# EAGLE design tvbgone3 (EAGLE 7.3.0)
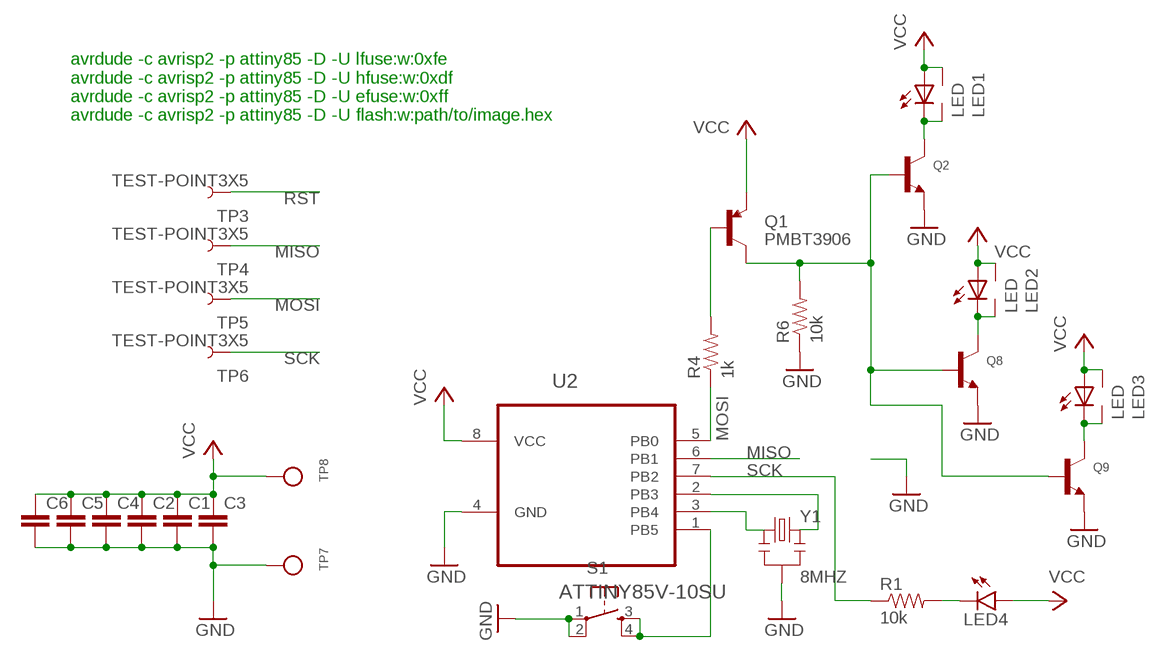
[diagram p0: schematic, sheet 1]

## Parts
C1  CAP0603-CAP  [0603-CAP]
C2  CAP0603-CAP  [0603-CAP]
C3  CAP0603-CAP  [0603-CAP]
C4  CAP0603-CAP  [0603-CAP]
C5  CAP0603-CAP  [0603-CAP]
C6  CAP0603-CAP  [0603-CAP]
LED1  LED  [5MM-SIDE]
LED2  LED  [5MM-SIDE]
LED3  LED  [5MM-SIDE]
LED4  LED0603  [LED-0603]
Q1  PMBT3906  TRANSISTOR_PNPPMBT3906  [SOT23-3]
Q2  TRANSISTOR_NPN  [SOT-23-R]
Q8  TRANSISTOR_NPN  [SOT-23-R]
Q9  TRANSISTOR_NPN  [SOT-23-R]
R1  10k  RESISTOR0603  [0603-RES]
R4  1k  RESISTOR0603  [0603-RES]
R6  10k  RESISTOR0603  [0603-RES]
S1  TAC_SWITCHSMD  [TACTILE-SWITCH-SMD]
TP3  TEST-POINT3X5  [PAD.03X.05]
TP4  TEST-POINT3X5  [PAD.03X.05]
TP5  TEST-POINT3X5  [PAD.03X.05]
TP6  TEST-POINT3X5  [PAD.03X.05]
TP7  TESTPOINTPAD  [TESTPOINT_PAD_2MM]
TP8  TESTPOINTPAD  [TESTPOINT_PAD_2MM]
U2  ATTINY85V-10SU  [SOIC127P798X216-8N]
Y1  8MHZ  RESONATOR8MHZ  [RESONATOR-SMD]

## Nets
GND: C1.2 C2.2 C3.2 C4.2 C5.2 C6.2 Q2.3-EMITTER(E) Q8.3-EMITTER(E) Q9.3-EMITTER(E) R6.1 S1.1 S1.2 TP7.P$1 U2.4(GND) Y1.2
MISO: TP4.P$1 U2.6(PB1)
MOSI: R4.1 TP5.P$1 U2.5(PB0)
N$1: U2.3(PB4) Y1.1
N$2: U2.2(PB3) Y1.3
N$3: LED4.C R1.2
N$4: LED1.K2(C1) LED1.K(C) Q2.2-COLLECTOR(C)
N$5: LED2.K2(C1) LED2.K(C) Q8.2-COLLECTOR(C)
N$6: Q1.1(B) R4.2
N$7: LED3.K2(C1) LED3.K(C) Q9.2-COLLECTOR(C)
N$10: Q1.3(C) Q2.1-BASE(B) Q8.1-BASE(B) Q9.1-BASE(B) R6.2
RST: S1.3 S1.4 TP3.P$1 U2.1(PB5)
SCK: R1.1 TP6.P$1 U2.7(PB2)
VCC: C1.1 C2.1 C3.1 C4.1 C5.1 C6.1 LED1.A LED1.A2(A1) LED2.A LED2.A2(A1) LED3.A LED3.A2(A1) LED4.A Q1.2(E) TP8.P$1 U2.8(VCC)

## Notes on the sheet
- avrdude -c avrisp2 -p attiny85 -D -U lfuse:w:0xfe
  avrdude -c avrisp2 -p attiny85 -D -U hfuse:w:0xdf
  avrdude -c avrisp2 -p attiny85 -D -U efuse:w:0xff
  avrdude -c avrisp2 -p attiny85 -D -U flash:w:path/to/image.hex

## Library data of the parts
C1-C6 = homemade-hardware:CAP: Capacitor Standard 0603 ceramic capacitor, and 0.1" leaded capacitor.
LED1-LED3 = tvbgone:LED
LED4 = homemade-hardware:LED: LEDs Standard schematic elements and footprints for 5mm, 3mm, 1206, and 0603 sized LEDs. 5mm - Spark Fun Electronics SKU : COM-00529 (and others)
Q1 = SparkFun-DiscreteSemi:TRANSISTOR_PNP: Generic PNP BJT Double check pinouts against datasheets- not all devices are the same! MMBT3906 - 40V 200mA SOT-23 (TRANS-08052) MMBT4403 - 40V 600mA SOT-23 (TRANS-09245); PROD_ID: TRANS-08052
Q2 Q8 Q9 = Tomorrow_Lab_LLC:TRANSISTOR_NPN: NPN Transistor Transistor (NPN) 500mA 45V - BC817 [Digikey: 568-1631-1-ND] SOT23-R - SOT23 footprint optimised for use with solder paste and reflow ovens. SOT23-W - SOT23 footprint optimised for hand-soldering (larger pads).
R1 R4 R6 = homemade-hardware:RESISTOR: Resistor Basic schematic elements and footprints for 0603, 1206, and PTH resistors.
S1 = SparkFun-Electromechanical:TAC_SWITCH: Momentary Switch Button commonly used for reset or general input. Spark Fun Electronics SKU : COM-00097 SMT- SWCH-08247
TP3-TP6 = SparkFun-Passives:TEST-POINT: Bare copper test points for troubleshooting or ICT
TP7 TP8 = microbuilder:TESTPOINT: Test Point Various test points for characterisation and PCB testing TESTPOINT_SMT - Compact Surface Mount Test Point [Digikey: 5016KTR-ND]
U2 = Atmel_By_element14_Batch_1:ATTINY85V-10SU: 8-bit Microcontroller with In-System Programmable Flash; MPN: ATTINY85V-10SU; OC_FARNELL: 1455166; OC_NEWARK: 58M3799; PACKAGE: SOIC-8; SUPPLIER: Atmel
Y1 = homemade-hardware:RESONATOR: Resonator Small SMD resonator. Used, eg, on the Arduino Pro/ Pro Mini boards. 8MHz- XTAL-08895 16MHz- XTAL-08900; PROD_ID: XTAL-08895

## Board
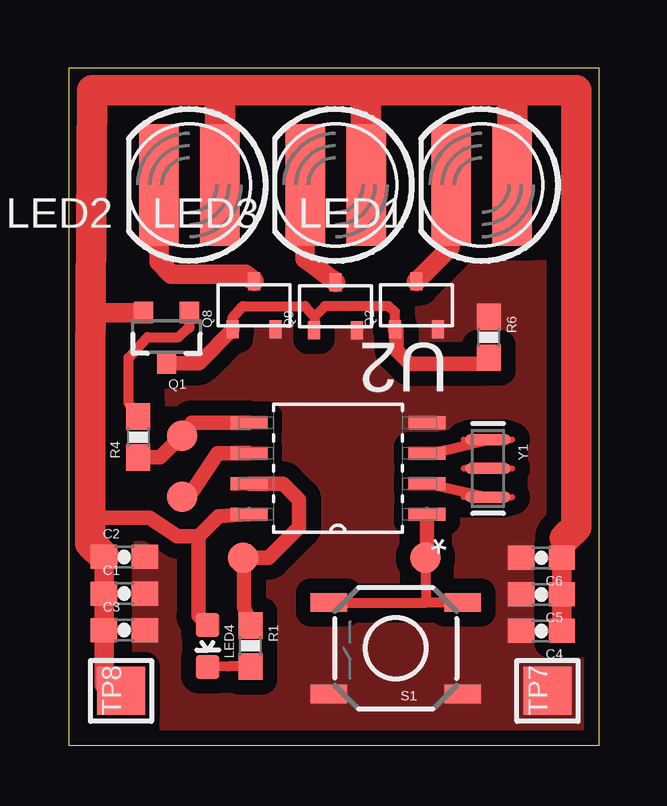
[diagram p1: board, top side]
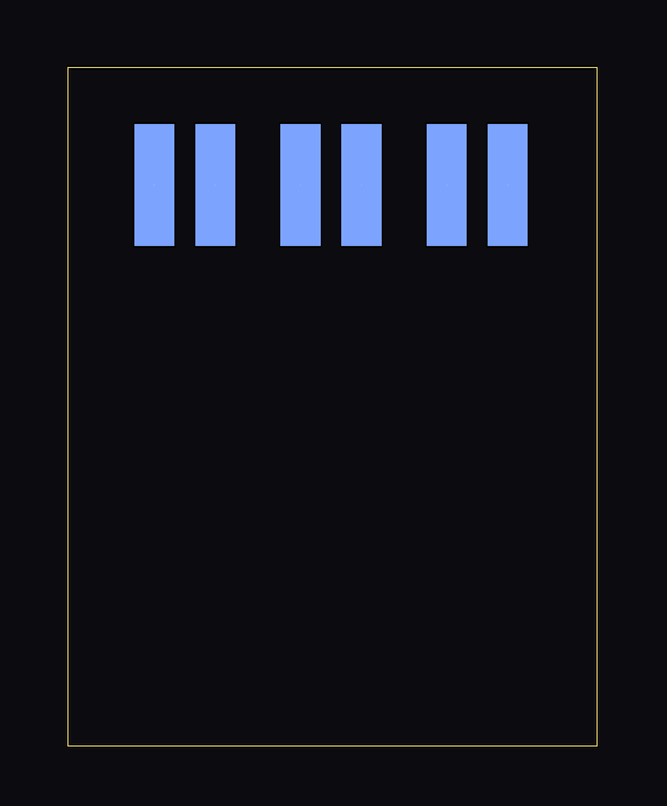
[diagram p2: board, bottom side, seen from below]

Size 22.1 x 28.26 mm. Coordinates in mm from the lower left corner, seen from the top.
Outline: 22.1,0 0,0 0,28.26 22.1,28.26 22.1,0
Copper layers (1*16): Top 0.035mm / dielectric 1.5mm / Bottom 0.035mm
Design rules "default *": minimum track width 10mil, minimum drill 20mil, track to track 12mil, track to pad 12mil, pad to pad 12mil, via to via 12mil, smd to smd 0mil, copper to edge 10mil, drill to drill 8mil, minimum pad ring 10mil, minimum via ring 8mil, stop-mask expansion 4mil, vias tented up to drill 0mil, thermal gap 10mil

### Footprints (pad centres in the part's own frame; a part is rotated, then mirrored left to right if it is on the bottom)
0603-CAP = smd 1.1 x 1: 1 -0.85,0; 2 0.85,0
5MM-SIDE = smd 1.651 x 5.08: A -1.27,0; K 1.27,0 | smd 1.651 x 5.08 bottom: A2 -1.27,0; K2 1.27,0
LED-0603 = smd 1 x 1: A 0,-0.877; C 0,0.877
SOT23-3 = smd 0.8 x 0.9: 1 -0.95,-1; 2 0.95,-1; 3 0,1.1
SOT-23-R = smd 0.5 x 0.75: 1-BASE -0.9,-1; 2-COLLECTOR 0,1; 3-EMITTER 0.9,-1
0603-RES = smd 1.1 x 1: 1 -0.85,0; 2 0.85,0
TACTILE-SWITCH-SMD = smd 1.524 x 0.762: 1 -2.794,1.905; 2 2.794,1.905; 3 -2.794,-1.905; 4 2.794,-1.905
PAD.03X.05 = smd 1.27 x 1.27: P$1 0,0
TESTPOINT_PAD_2MM = smd 2 x 2: P$1 0,0
SOIC127P798X216-8N = smd 1.549 x 0.533: 1 -3.708,1.905; 2 -3.708,0.635; 3 -3.708,-0.635; 4 -3.708,-1.905; 5 3.708,-1.905; 6 3.708,-0.635; 7 3.708,0.635; 8 3.708,1.905
RESONATOR-SMD = smd 0.45 x 1.905: 1 -1.2,0; 2 0,0; 3 1.2,0

### Placement (x,y rotation side)
C1  2.31,6.34 0 top
C2  2.31,7.87 0 top
C3  2.31,4.82 0 top
C4  19.7,4.79 180 top
C5  19.7,6.31 180 top
C6  19.7,7.84 180 top
LED1  17.21,23.37 180 top
LED2  5.02,23.37 180 top
LED3  11.11,23.37 180 top
LED4  5.78,4.16 180 top
Q1  4.06,17.05 180 top
Q2  14.48,18.35 0 top
Q8  7.72,18.35 0 top
Q9  11.11,18.32 0 top
R1  7.56,4.16 270 top
R4  2.89,12.87 90 top
R6  17.49,17.02 270 top
S1  13.62,4.06 180 top
TP3  14.87,7.84 180 top
TP4  4.71,10.38 270 top
TP5  4.71,12.92 270 top
TP6  7.25,7.84 270 top
TP7  19.95,2.29 90 top
TP8  2.17,2.29 90 top
U2  11.21,11.56 180 top
Y1  17.46,11.56 270 top

### Tracks (layer width: path | path; a pad name or v marks a point on that pad's centre or on a via)
GND
  pour Top (isolate 0.61, no thermals): -0.06,29.18 22.8,29.18 22.8,-0.03 -0.06,-0.03
MISO
  Top 0.61: U2.6 6.19,12.19 5.14,10.64 4.89,10.57 TP4.P$1
MOSI
  Top 0.61: U2.5 5.12,13.46 TP5.P$1 3.8,12.02 R4.1
N$1
  Top 0.406: U2.3 15.68,12.32 Y1.1
N$2
  Top 0.406: U2.2 15.56,10.8 Y1.3
N$3
  Top 0.406: R1.2 6.64,3.31 LED4.C
N$4  (1 unrouted)
  Top 0.813: LED1.K2 15.87,20.75 Q2.2-COLLECTOR
N$5  (1 unrouted)
  Top 0.813: LED2.K2 3.75,20.16 4.25,19.65 7.35,19.65 Q8.2-COLLECTOR
N$6
  Top 0.406: R4.2 2.76,13.93 2.48,14.28 2.48,16.17 3.26,17.02 4.57,17.02 5.02,17.47 5.02,17.41 Q1.1
N$7  (1 unrouted)
  Top 0.813: LED3.K2 9.84,20.29 11.03,19.4 Q9.2-COLLECTOR
N$10
  Top 0.406: Q2.1-BASE 13.58,18.08 | 13.58,18.08 13.34,18.32 10.67,18.32 10.22,17.88 | 10.22,17.88 10.22,17.33 Q9.1-BASE | Q8.1-BASE 6.82,17.83 7.24,18.32 9.84,18.32 10.22,17.88 | 13.58,18.08 13.6,18.08
  Top 0.61: Q1.3 5.41,15.95 Q8.1-BASE | Q2.1-BASE 13.65,17.28 13.65,16.48 14.22,15.91 17.24,15.91 R6.2
RST
  Top 0.406: S1.4 14.85,5.97 | 14.85,5.97 14.9,5.97 | 14.9,5.97 14.89,6.18 | 14.89,6.18 TP3.P$1 | S1.3 14.9,5.97 | 14.85,5.97 14.89,6.18
  Top 0.61: U2.1 14.92,7.72 15.04,7.84 TP3.P$1
SCK
  Top 0.406: 7.3,7.79 TP6.P$1
  Top 0.61: 7.3,7.79 7.3,5.77 R1.1 | U2.7 8.92,10.92 9.59,10.26 9.59,9.11 8.32,7.84 TP6.P$1
VCC  (3 unrouted)
  Top 0.61: U2.8 6.23,9.56 5.4,8.73 | 5.4,8.73 4.51,8.73 3.37,9.49 0.89,9.49 | 5.4,8.73 5.4,5.42 LED4.A
  Top 0.813: C2.1 C1.1 C3.1 1.46,2.55 TP8.P$1 | C4.1 C5.1 C6.1 20.67,8.64 | 0.95,18.39 0.93,17.51 | 0.93,17.51 0.89,15.81 | Q1.2 1.03,18.05 0.93,17.51
  Top 1.27: 18.48,27.31 21.15,27.31 21.15,9.11 20.67,8.64 | 18.48,27.31 12.38,27.31 | 12.38,27.31 6.29,27.31 | 6.29,27.31 0.95,27.31 0.89,15.81 0.89,9.49 0.89,8.43 C2.1 | LED2.A2 6.29,27.31 | LED3.A 12.38,27.31 | LED1.A 18.48,27.31